# Altium schematic sheet [1]Supply.SchDoc
size A4; DocumentNumber: 2; SheetNumber: 2; SheetTotal: 5
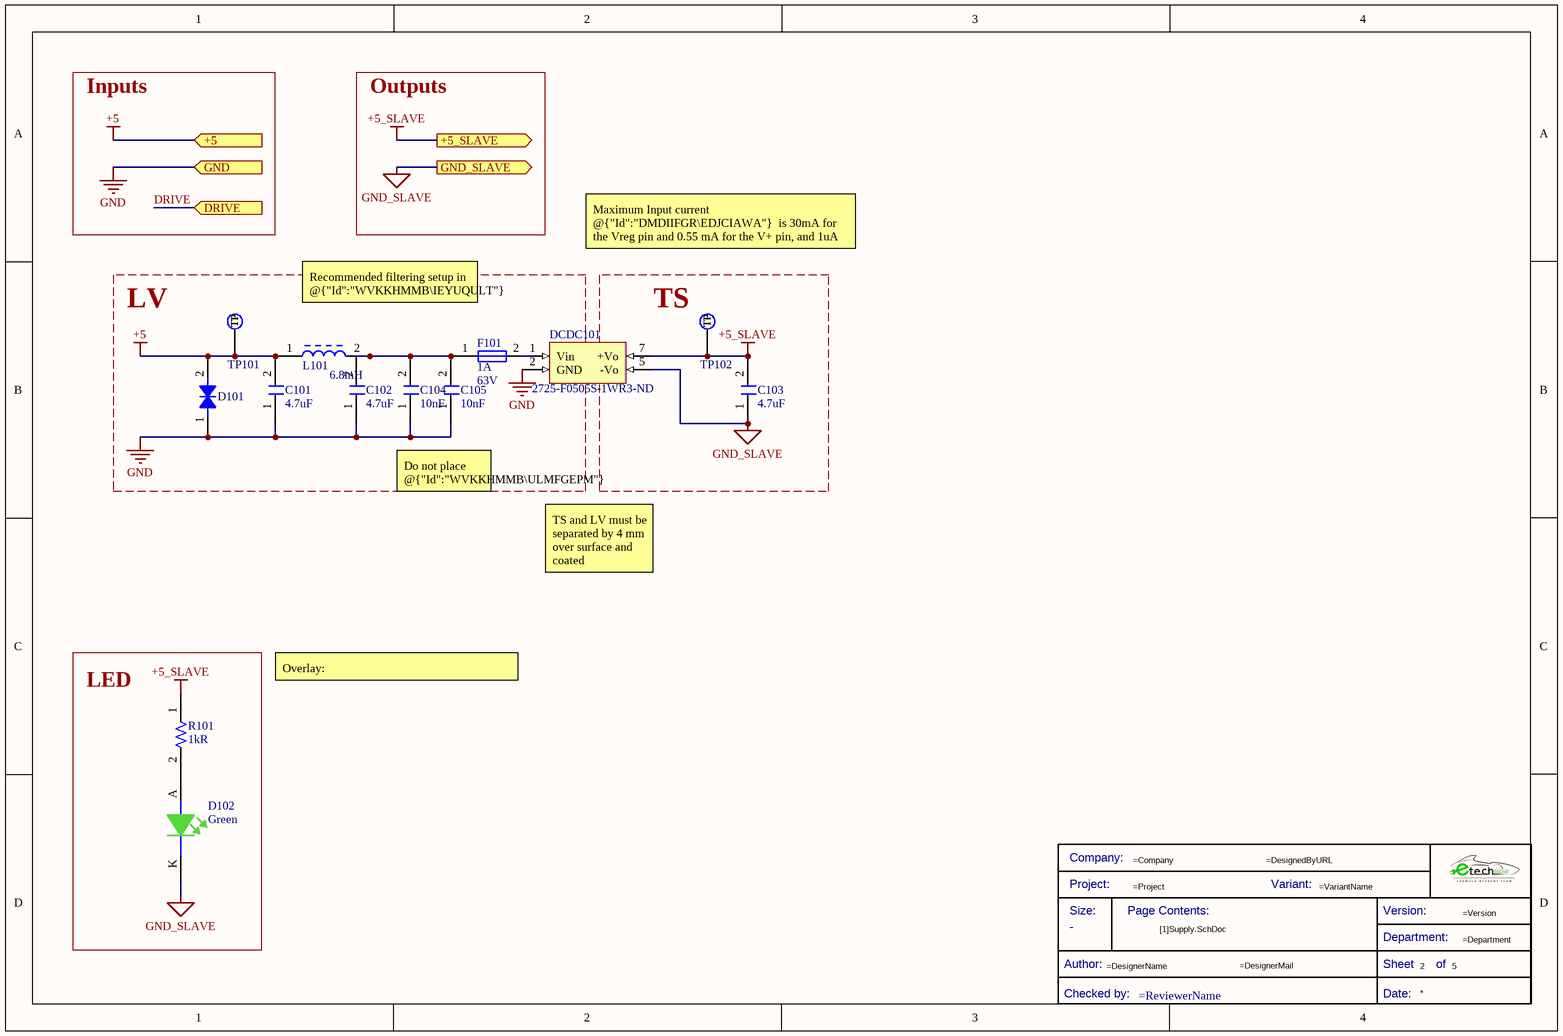
[diagram p0: [1]Supply.SchDoc]

## Parts
*?  Title Block_template  (value not drawn)  (graphical)
C101  4.7uF  [C0805FNPC-R]
C102  4.7uF  [C0805FNPC-R]
C103  4.7uF  [C0805FNPC-R]
C104  Capacitance: 10nF  [C0805FNPC-R]  (hidden comment: 885012207092)
C105  Capacitance: 10nF  [C0805FNPC-R]  (hidden comment: 885012207092)
D101  824501600  [DTVS-DO-214AC]  (value not drawn)
D102  Color: Green  [LED_0805_WE]  (hidden comment: 150080GS75000)
DCDC101  Supplier Part Number 1: 2725-F0505S-1WR3-ND  [F_S-1WR3]  (hidden comment: DCDC-5V/5V-0.2A)
F101  Current Rating: 1A  Voltage Rating (DC): 63V  [Fuse_1206]  (hidden comment: 0437001.WRA)
L101  6.8mH  [C0805FNPC-R]
R101  Resistance: 1kR  [R0805FTK]  (hidden comment: CR0805-JW-102ELF)
TP101  TestPoint  [TestPoint]  (value not drawn)  (no BOM)
TP102  TestPoint  [TestPoint]  (value not drawn)  (no BOM)

## Blocks framed on the sheet
LV: C101 C102 C104 C105 D101 F101 L101 TP101
TS: C103 TP102
LED: D102 R101

## Ports
+5 (in), +5_SLAVE (out), DRIVE (in), GND (in), GND_SLAVE (out)

## Nets
+5: C101.2 D101.2 L101.1 TP101.1(TP) ; port +5
+5_SLAVE: C103.2 DCDC101.7(+Vo) R101.1 TP102.1(TP) ; port +5_SLAVE
GND: C101.1 C102.1 C104.1 C105.1 D101.1 DCDC101.2(GND) ; port GND
GND_SLAVE: C103.1 D102.K DCDC101.5(-Vo) ; port GND_SLAVE
DRIVE: port DRIVE
NetC102_2: C102.2 C104.2 C105.2 F101.1 L101.2
NetD102_A: D102.A R101.2
NetDCDC101_1: DCDC101.1(Vin) F101.2

## Notes on the sheet
- Inputs
- Outputs
- Maximum Input current @{"Id":"DMDIIFGR\EDJCIAWA"}  is 30mA for the Vreg pin and 0.55 mA for the V+ pin, and 1uA for @{"Id":"PAANUOYX\HCOCLAAI"}
- Recommended filtering setup in @{"Id":"WVKKHMMB\IEYUQULT"} datasheet.
- Do not place @{"Id":"WVKKHMMB\ULMFGEPM"} @{"Id":"WVKKHMMB\PBSTWFNK"}
- TS and LV must be separated by 4 mm over surface and coated
- Overlay: @{"Id":"WVKKHMMB\YSBLHOTO"} is the +5V supply  indicator
- (in symbol Title Block_template) Company:; Project:; Variant:; Size:; Page Contents:; Version:; Department:; Author:; Sheet; of; Checked by:; Date:

## Library data of the parts
*? = Title Block_template: Standard Title Block; .Creator: GP; Category: Title Block; .PCBcheck: GP; .SCHcheck: GP; Checked by:: =ReviewerName; Size: -
C101-C103 = C4.7uF-25V: Multilayer Ceramic Capacitor, Wcap-Csgp Series, 4.7 F, 20%, X5R, 25 V, 0805 [2012 Metric] Rohs Compliant: Yes |Wurth...; Manufacturer: Wurth Electronics; Manufacturer Part Number: 885012107018; Supplier 1: Rs; RoHS: Yes; Category: Ceramic Capacitors; Stock 1: 1051; Pricing 1: 50=0,141, 500=0,093, 1500=0,088 (EUR); ComponentLink1URL: http://www.farnell.com/datasheets/1958455.pdf?src-supplier=Farnell; ComponentLink1Description: http://www.farnell.com/datasheets/1958455.pdf?src-supplier=Farnell; ComponentLink2URL: http://www.farnell.com/datasheets/1958455.pdf?src-supplier=Element14; ComponentLink2Description: http://www.farnell.com/datasheets/1958455.pdf?src-supplier=Element14; ComponentLink3URL: http://www.farnell.com/datasheets/1958455.pdf?src-supplier=Newark; ComponentLink3Description: http://www.farnell.com/datasheets/1958455.pdf?src-supplier=Newark; ComponentLink4URL: https://katalog.we-online.de/pbs/datasheet/885012107018.pdf?src-supplier=Digi-Key; ComponentLink4Description: https://katalog.we-online.de/pbs/datasheet/885012107018.pdf?src-supplier=Digi-Key; Supplier Part Number 1: 1813478
C104 C105 = C10n-50V-0805FNPC-X7R: Cap, 0.01ΜF, 50V, 10%, X7R, 0805; Manufacturer 1: Wurth Electronics; .Creator: DR; Supplier 1: RSComponents; Manufacturer Part Number 1: 885012207092; RoHS: Yes; Category: Ceramic Capacitors; Stock 1: 1; Pricing 1: 4000=0,03200, 12000=0,03100 (USD); Mount: Surface Mount; Case/Package: 0805; Case Code (Metric): 2012; Case Code (Imperial): 0805; Min Operating Temperature: -55°C; Max Operating Temperature: 125°C; Packaging: Cut Tape; Voltage Rating: 50V; Dielectric: X7R; Tolerance: 10%; Voltage Rating (DC): 50V; Length: 0.079inch; Width: 0.049inch; Thickness: 0.035inch; REACH SVHC: Unknown; RoHS Compliant: Yes; ComponentLink1URL: http://www.farnell.com/datasheets/1958497.pdf?src-supplier=Farnell; ComponentLink1Description: http://www.farnell.com/datasheets/1958497.pdf?src-supplier=Farnell; ComponentLink2URL: http://www.farnell.com/datasheets/1958497.pdf?src-supplier=Element14; ComponentLink2Description: http://www.farnell.com/datasheets/1958497.pdf?src-supplier=Element14; ComponentLink3URL: http://www.farnell.com/datasheets/1958497.pdf?src-supplier=Newark; ComponentLink3Description: http://www.farnell.com/datasheets/1958497.pdf?src-supplier=Newark; ComponentLink4URL: https://katalog.we-online.de/pbs/datasheet/885012207092.pdf?src-supplier=Digi-Key; ComponentLink4Description: https://katalog.we-online.de/pbs/datasheet/885012207092.pdf?src-supplier=Digi-Key; Supplier Part Number 1: 1813941
D101 = DTVS-6V-DO-214AC: TVS diode [Würth Elektronik] 824501600 TVS diode; Manufacturer: Wurth Electronics; Number of Bidirectional Channels: 1; Reverse Standoff Voltage: 6V; Min Breakdown Voltage: 7.02V; Clamping Voltage: 10.3V; Peak Pulse Power: 400W; Power Line Protection: No; Polarity: Bidirectional; Peak Pulse Current: 38.8A; .Creator: DO; ComponentLink1Description: Where buy it; ComponentLink1URL: https://www.we-online.com/catalog/en/WE-TVSP?sq=824501600#824501600; Supplier 1: Mouser; Manufacturer Part Number: 824501600; RoHS: Yes; Category: TVS Diodes; Stock 1: 780; Pricing 1: 1=0,28000, 10=0,26100, 50=0,26100, 100=0,23400, 500=0,20400, 1000=0,17400, 10000=0,17400 (USD); Mount: Surface Mount; Number of Pins: 2; Min Operating Temperature: -65°C; Max Operating Temperature: 150°C; Packaging: Cut Tape; Max Breakdown Voltage: 7.02V; Resistor Type: Zener; REACH SVHC: Unknown; RoHS Compliant: Yes; ComponentLink2URL: http://www.farnell.com/datasheets/2036401.pdf?src-supplier=Element14; ComponentLink2Description: http://www.farnell.com/datasheets/2036401.pdf?src-supplier=Element14; Supplier Part Number 1: 710-824501600; ComponentLink3URL: https://katalog.we-online.de/pbs/datasheet/824501600.pdf?src-supplier=Digi-Key; ComponentLink3Description: https://katalog.we-online.de/pbs/datasheet/824501600.pdf?src-supplier=Digi-Key
D102 = LEDGS-0805-450: Led, Green, 520 Nm, 3.2 V, 30 Ma, 450 Mcd Rohs Compliant: Yes; Manufacturer 1: Wurth Electronics; Viewing Angle: 140°; Lens Style: Clear,Rectangular; Luminous Intensity: 450mcd; Forward Voltage: 3.2V; Wavelength: 520nm; Forward Current: 30mA; Test Current: 20mA; .Creator: GP; ComponentLink1Description: Datasheet; ComponentLink1URL: https://www.we-online.com/catalog/datasheet/150080GS75000.pdf; ComponentLink2Description: Where buy it; ComponentLink2URL: https://katalog.we-online.de/en/led/WL-SMCW/150080GS75000; Supplier 1: RSComponents; Manufacturer Part Number 1: 150080GS75000; RoHS: Yes; Category: LEDs; Stock 1: 4350; Pricing 1: 50=0,19300, 500=0,12900, 1000=0,12300, 2000=0,11700, 4000=0,11100 (USD); Mount: Surface Mount; Case/Package: 0805; Case Code (Metric): 2012; Case Code (Imperial): 0805; Min Operating Temperature: -40°C; Max Operating Temperature: 85°C; Package Quantity: 4000; Packaging: Cut Tape; Dominant Wavelength: 520nm; Length: 2mm; Width: 1.25mm; Height: 0.7mm; REACH SVHC: Unknown; RoHS Compliant: Yes; ComponentLink3URL: https://datasheet.ciiva.com/29563/150080gs75000-29563008.pdf?src-supplier=Digi-Key; ComponentLink3Description: https://datasheet.ciiva.com/29563/150080gs75000-29563008.pdf?src-supplier=Digi-Key; ComponentLink4URL: https://datasheet.ciiva.com/29279/759434-da-01-en-chipled-0805-w-kl-gruen-150080gs75000-29279039.pdf?src-supplier=Conrad; ComponentLink4Description: https://datasheet.ciiva.com/29279/759434-da-01-en-chipled-0805-w-kl-gruen-150080gs75000-29279039.pdf?src-supplier=Conrad; Supplier Part Number 1: 8154221
DCDC101 = DCDC-5V/5V-0.2A: Module DC-DC 5VIN 1-OUT 5V 0.2A 1W 4-Pin SIP Module Bag; Manufacturer: MORNSUN; Manufacturer Part Number: F0505S-1WR3; Supplier 1: Digi-Key; RoHS: No; Category: Board Mount Modules; Stock 1: 23492; Pricing 1: 1=2,32, 5=2,288, 10=2,255, 25=2,1884, 50=2,1222, 100=2,0559, 250=1,98956, 500=1,85692 (USD); ComponentLink1Description: New link; ComponentLink1URL: *
F101 = Fuse_1A_63V_1206: Fuse Chip Fast Acting 1A 63V SMD Solder Pad 1206 Ceramic T/R Automotive; Manufacturer: Littelfuse; Fuse Type: Board Mount (Cartridge Style Excluded); Approvals: CSA,cURus; .Creator: DO; Supplier 1: Digi-Key; Manufacturer Part Number: 0437001.WRA; RoHS: Yes; Category: Fuses; Stock 1: 5820; Pricing 1: 1=1,52000, 5=1,47000, 10=1,37600, 50=1,13860, 100=0,94880, 250=0,92508, 500=0,78276, 1000=0,68788 (USD); Mount: Surface Mount; Case/Package: 1206; Case Code (Imperial): 1206; Case Code (Metric): 3216; Min Operating Temperature: -55°C; Max Operating Temperature: 150°C; Packaging: Tape and Reel; Voltage Rating (AC): 63V; ComponentLink1URL: https://www.littelfuse.com/~/media/electronics/datasheets/fuses/littelfuse_fuse_437a_datasheet.pdf.pdf?src-supplier=Digi-Key; ComponentLink1Description: https://www.littelfuse.com/~/media/electronics/datasheets/fuses/littelfuse_fuse_437a_datasheet.pdf.pdf?src-supplier=Digi-Key; Supplier Part Number 1: F10001CT-ND; ComponentLink2Description: Where buy it; ComponentLink2URL: https://www.mouser.es/ProductDetail/Littelfuse/0437001WRA?qs=DXv0QSHKF4z9CJhPXjxR%252BA%3D%3D
L101 = L_Ferrite_Bread_6.8mH: Multilayer Inductor, 6.8Uh, 0.6A, 0805 Rohs Compliant: Yes |Wurth Elektronik 74479777268; Manufacturer: Wurth Electronics; Supplier 1: Farnell; Manufacturer Part Number: 74479777268; RoHS: No; Category: Fixed Inductors; Stock 1: 2165; Pricing 1: 5=0,845, 50=0,759, 250=0,658, 500=0,569, 1500=0,528, 3000=0,514, 15000=0,498, 30000=0,48 (EUR)
R101 = R1k-0805FTK: Res Thick Film 0805 1K Ohm 5% 1/8W ±200ppm/°C Molded SMD SMD Paper Tape on Plastic Reel; Manufacturer 1: Bourns; Voltage Rating (DC): 150V; Power Rating: 125mW; .Creator: GP; Supplier 1: Arrow Electronics; Manufacturer Part Number 1: CR0805-JW-102ELF; RoHS: Yes; Category: Chip SMD Resistors; Stock 1: 27510; Pricing 1: 1=0,05930, 10=0,03510, 25=0,01790, 100=0,00800, 250=0,00790, 500=0,00590, 1000=0,00360, 3000=0,00350, 6000=0,00250 (USD); Mount: Surface Mount; Case/Package: 0805; Number of Pins: 2; Contact Plating: Tin; Case Code (Metric): 2012; Case Code (Imperial): 0805; Min Operating Temperature: -55°C; Max Operating Temperature: 155°C; Resistor Type: Thick Film; Tolerance: 5%; Temperature Coefficient: 200ppm/°C; Features: Moisture Resistant; Package Quantity: 1; Packaging: Tape and Reel; Voltage Rating: 150V; Number of Terminations: 2; Termination: SMD/SMT; Max Power Dissipation: 125mW; Length: 2mm; Width: 1.25mm; Height: 0.5mm; Thickness: 508um; Depth: 1.25mm; Radiation Hardening: No; Lead Free: Lead Free; REACH SVHC: No SVHC; Military Standard: Not; ComponentLink1URL: https://datasheet.ciiva.com/11821/0900766b80fcdb72-11821134.pdf?src-supplier=RSComponents; ComponentLink1Description: https://datasheet.ciiva.com/11821/0900766b80fcdb72-11821134.pdf?src-supplier=RSComponents; ComponentLink2URL: https://datasheet.ciiva.com/15225/getdatasheetpartid-78155-15225381.pdf?src-supplier=Verical; ComponentLink2Description: https://datasheet.ciiva.com/15225/getdatasheetpartid-78155-15225381.pdf?src-supplier=Verical; ComponentLink3URL: https://datasheet.ciiva.com/22693/1902866-22693253.pdf?src-supplier=Element14; ComponentLink3Description: https://datasheet.ciiva.com/22693/1902866-22693253.pdf?src-supplier=Element14; ComponentLink4URL: https://datasheet.ciiva.com/7986/1856384-7986184.pdf?src-supplier=Element14; ComponentLink4Description: https://datasheet.ciiva.com/7986/1856384-7986184.pdf?src-supplier=Element14; ComponentLink5URL: https://datasheet.ciiva.com/7985/1856384-7985867.pdf?src-supplier=Element14; ComponentLink5Description: https://datasheet.ciiva.com/7985/1856384-7985867.pdf?src-supplier=Element14; ComponentLink6URL: https://datasheet.ciiva.com/30242/159chpreztr-30242765.pdf?src-supplier=Onlinecomponents.com; ComponentLink6Description: https://datasheet.ciiva.com/30242/159chpreztr-30242765.pdf?src-supplier=Onlinecomponents.com; ComponentLink7URL: https://datasheet.ciiva.com/6547/chpreztr-6547359.pdf?src-supplier=Digi-Key; ComponentLink7Description: https://datasheet.ciiva.com/6547/chpreztr-6547359.pdf?src-supplier=Digi-Key; Supplier Part Number 1: CR0805-JW-102ELF
TP101 TP102 = TestPoint: Test Point 1x1 mm; .Creator: GP; Category: TestPoint; .PCBcheck: GP; .SCHcheck: GP